# EAGLE design primer_piso (EAGLE 7.6.0)
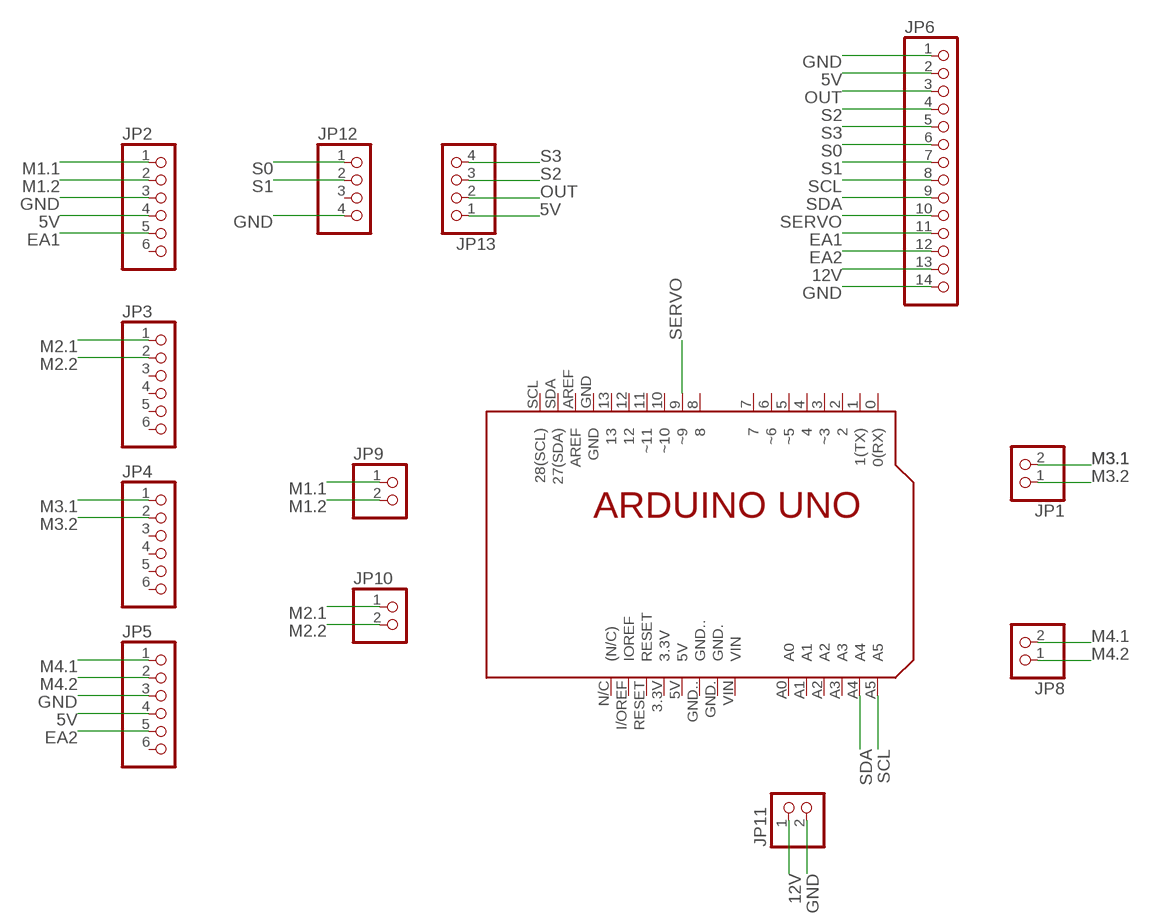
[diagram p0: schematic, sheet 1]

## Parts
JP1  PINHD-1X2  [1X02]
JP2  PINHD-1X6  [1X06]
JP3  PINHD-1X6  [1X06]
JP4  PINHD-1X6  [1X06]
JP5  PINHD-1X6  [1X06]
JP6  PINHD-1X14  [1X14]
JP8  PINHD-1X2  [1X02]
JP9  PINHD-1X2  [1X02]
JP10  PINHD-1X2  [1X02]
JP11  PINHD-1X2  [1X02]
JP12  PINHD-1X4  [1X04]
JP13  PINHD-1X4  [1X04]
UNO1  UNO  [UNO]

## Nets
5V: JP2.4 JP5.4 JP6.2 JP13.1
12V: JP6.13 JP11.1
EA1: JP2.5 JP6.11
EA2: JP5.5 JP6.12
GND: JP2.3 JP5.3 JP6.1 JP6.14 JP11.2 JP12.4
M1.1: JP2.1 JP9.1
M1.2: JP2.2 JP9.2
M2.1: JP3.1 JP10.1
M2.2: JP3.2 JP10.2
M3.1: JP1.2 JP4.1
M3.2: JP1.1 JP4.2
M4.1: JP5.1 JP8.2
M4.2: JP5.2 JP8.1
OUT: JP6.3 JP13.2
S0: JP6.6 JP12.1
S1: JP6.7 JP12.2
S2: JP6.4 JP13.3
S3: JP6.5 JP13.4
SCL: JP6.8 UNO1.A5
SDA: JP6.9 UNO1.A4
SERVO: JP6.10 UNO1.9(~9)
Unconnected: JP2.6 JP3.3 JP3.4 JP3.5 JP3.6 JP4.3 JP4.4 JP4.5 JP4.6 JP5.6 JP12.3 UNO1.0(0(RX)) UNO1.1(1(TX)) UNO1.2 UNO1.3(~3) UNO1.3.3V UNO1.4 UNO1.5(~5) UNO1.5V UNO1.6(~6) UNO1.7 UNO1.8 UNO1.10(~10) UNO1.11(~11) UNO1.12 UNO1.13 UNO1.A0 UNO1.A1 UNO1.A2 UNO1.A3 UNO1.AREF UNO1.GND UNO1.GND. UNO1.GND.. UNO1.I/OREF(IOREF) UNO1.N/C((N/C)) UNO1.RESET UNO1.SCL(28(SCL)) UNO1.SDA(27(SDA)) UNO1.VIN

## Library data of the parts
JP1 JP8-JP11 = pinhead:PINHD-1X2: PIN HEADER
JP2-JP5 = pinhead:PINHD-1X6: PIN HEADER
JP6 = pinhead:PINHD-1X14: PIN HEADER
JP12 JP13 = pinhead:PINHD-1X4: PIN HEADER
UNO1 = ROBORREGOS:UNO

## Board
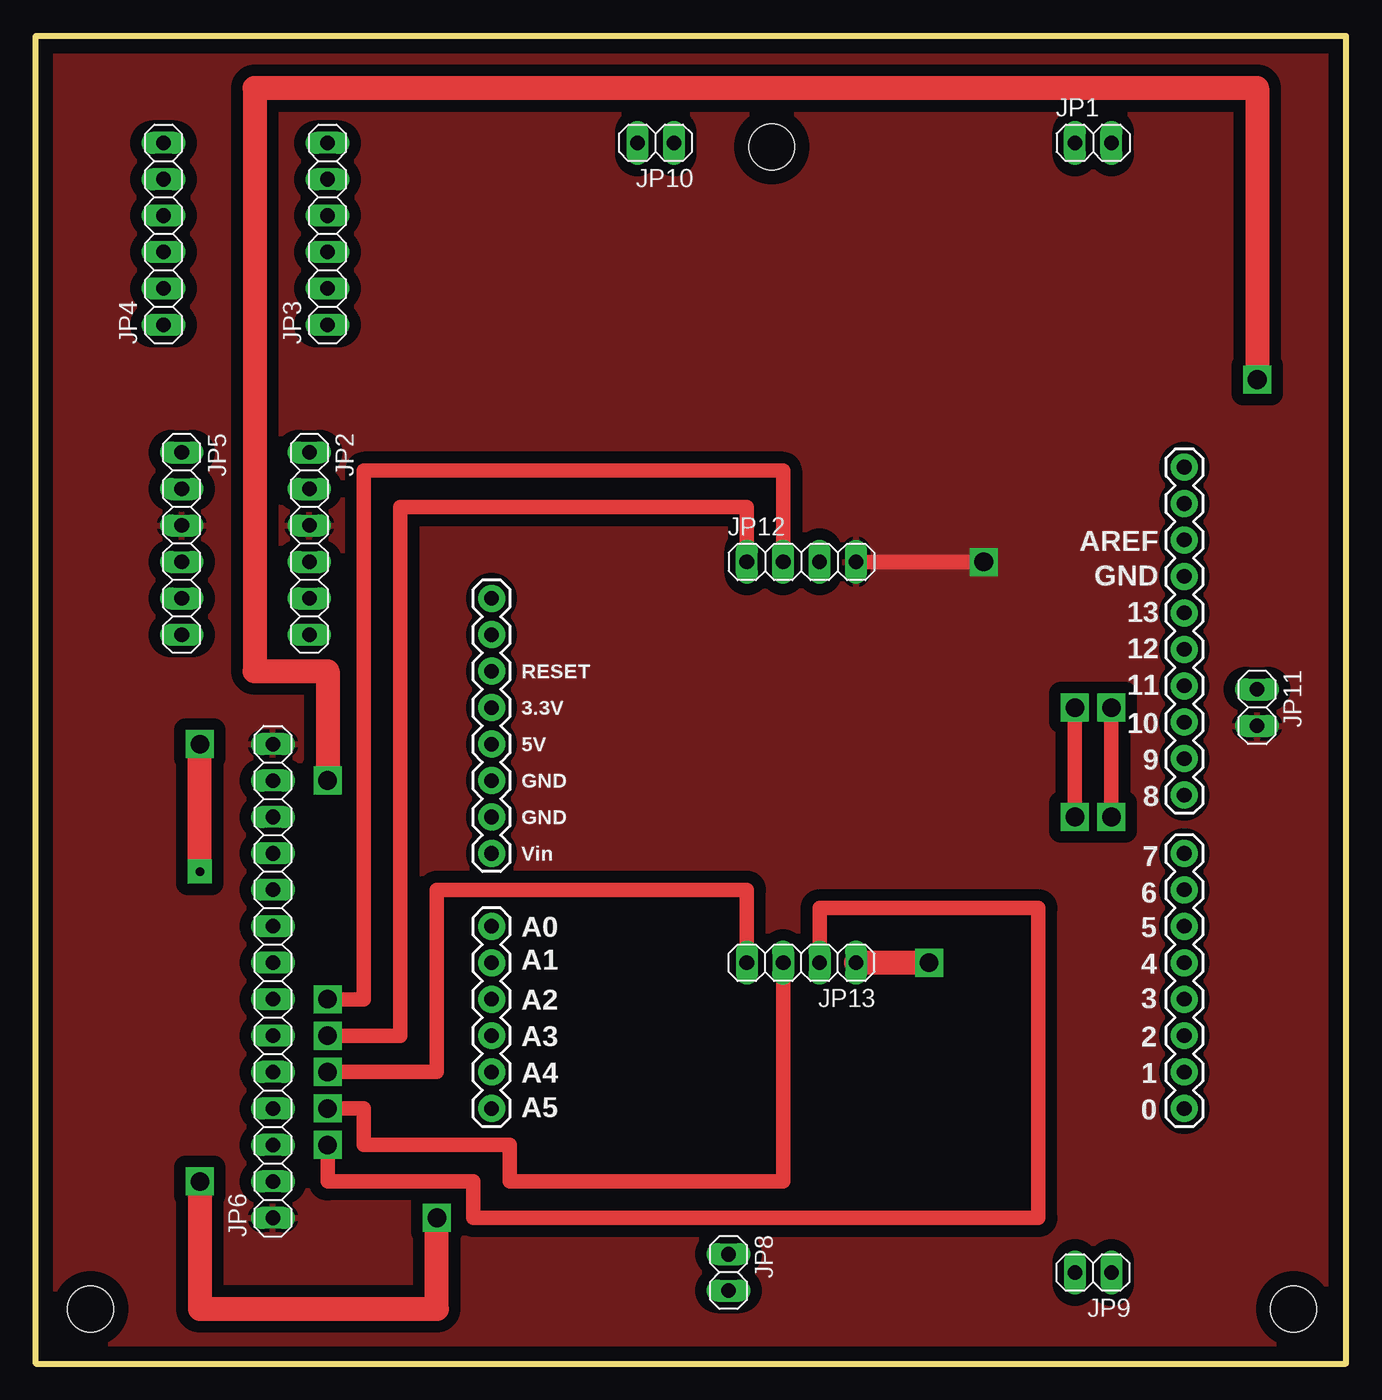
[diagram p1: board, top side]
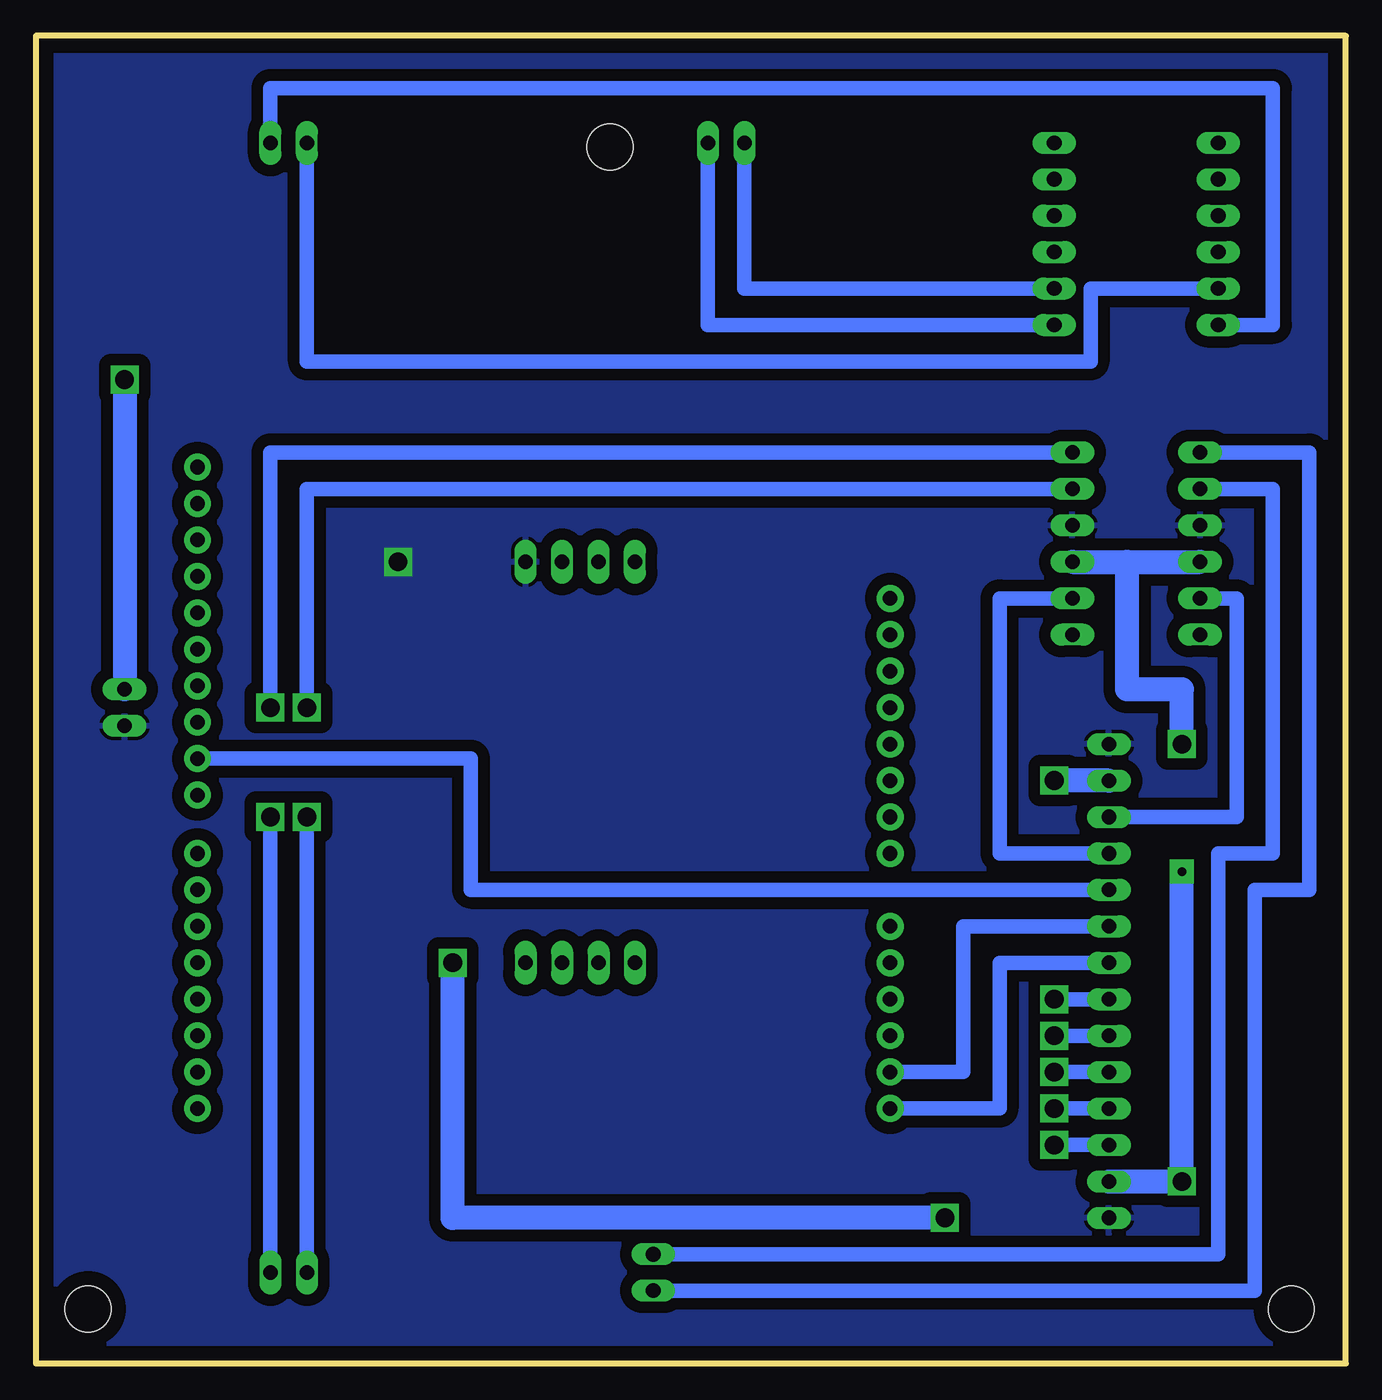
[diagram p2: board, bottom side, seen from below]

Size 91.27 x 92.54 mm. Coordinates in mm from the lower left corner, seen from the top.
Outline: 0,0 91.27,0 91.27,92.54 0,92.54 0,0
Copper layers (1*16): Top 0.035mm / dielectric 1.5mm / Bottom 0.035mm
Design rules "default": minimum track width 10mil, minimum drill 24mil, track to track 8mil, track to pad 8mil, pad to pad 8mil, via to via 8mil, smd to smd 8mil, copper to edge 40mil, drill to drill 8mil, minimum pad ring 10mil, minimum via ring 8mil, stop-mask expansion 4mil, vias tented up to drill 0mil, thermal gap 10mil
Holes 3.2 mm at 3.81,3.81 87.63,3.81 51.27,84.81

### Footprints (pad centres in the part's own frame; a part is rotated, then mirrored left to right if it is on the bottom)
1X02 = drill 1.016 long: 1 -1.27,0; 2 1.27,0
1X06 = drill 1.016 long: 1 -6.35,0; 2 -3.81,0; 3 -1.27,0; 4 1.27,0; 5 3.81,0; 6 6.35,0
1X14 = drill 1.016 long: 1 -16.51,0; 2 -13.97,0; 3 -11.43,0; 4 -8.89,0; 5 -6.35,0; 6 -3.81,0; 7 -1.27,0; 8 1.27,0; 9 3.81,0; 10 6.35,0; 11 8.89,0; 12 11.43,0; 13 13.97,0; 14 16.51,0
1X04 = drill 1.016 long: 1 -3.81,0; 2 -1.27,0; 3 1.27,0; 4 3.81,0
UNO = drill 1.016 pad 1.88: 0 31.75,24.13; 1 29.21,24.13; 2 26.67,24.13; 3 24.13,24.13; 3.3V 3.81,-24.13; 4 21.59,24.13; 5 19.05,24.13; 5V 6.35,-24.13; 6 16.51,24.13; 7 13.97,24.13; 8 9.906,24.13; 9 7.366,24.13; 10 4.826,24.13; 11 2.286,24.13; 12 -0.254,24.13; 13 -2.794,24.13; A0 19.05,-24.13; A1 21.59,-24.13; A2 24.13,-24.13; A3 26.67,-24.13; A4 29.21,-24.13; A5 31.75,-24.13; AREF -7.874,24.13; GND -5.334,24.13; GND. 11.43,-24.13; GND.. 8.89,-24.13; I/OREF -1.27,-24.13; N/C -3.81,-24.13; RESET 1.27,-24.13; SCL -12.954,24.13; SDA -10.414,24.13; VIN 13.97,-24.13

### Placement (x,y rotation side)
JP1  73.66,85.09 0 top
JP2  19.05,57.15 270 top
JP3  20.32,78.74 90 top
JP4  8.89,78.74 90 top
JP5  10.16,57.15 270 top
JP6  16.51,26.67 90 top
JP8  48.26,6.35 270 top
JP9  73.66,6.35 180 top
JP10  43.18,85.09 180 top
JP11  85.09,45.72 270 top
JP12  53.34,55.88 0 top
JP13  53.34,27.94 180 top
UNO1  55.88,49.53 270 top

### Tracks (layer width: path | path; a pad name or v marks a point on that pad's centre or on a via)
5V  (via drill 0.6 pad 1.68, 1.3, 1.3 pad 1.68)
  Top 1.676: v11.43,34.29 v11.43,43.18 | v11.43,12.7 11.43,3.81 27.94,3.81 v27.94,10.16 | v62.23,27.94 JP13.1
  Bottom 1.676: JP6.2 v11.43,12.7 v11.43,34.29 | v11.43,43.18 11.43,46.99 15.24,46.99 15.24,55.88 | 15.24,55.88 JP5.4 | JP2.4 15.24,55.88 | v27.94,10.16 62.23,10.16 v62.23,27.94
12V  (via drill 1.3, 1.3 pad 1.68)
  Top 1.676: v20.32,40.64 20.32,48.26 15.24,48.26 15.24,88.9 85.09,88.9 v85.09,68.58
  Bottom 1.676: v85.09,68.58 JP11.1 | JP6.13 v20.32,40.64
EA1
  Bottom 1.016: JP6.11 24.13,35.56 24.13,53.34 JP2.5
EA2
  Bottom 1.016: JP5.5 7.62,53.34 7.62,38.1 JP6.12
GND  (via drill 1.3)
  Top 1.016: JP12.4 v66.04,55.88
  Bottom 0.406: 86.36,44.45 JP11.2
  pour Bottom (isolate 0.813): -1.27,93.98 92.71,93.98 92.71,-1.27 -1.27,-1.27
  pour Top (isolate 0.813): -1.27,93.98 92.71,93.98 92.71,-1.27 -1.27,-1.27
M1.1  (via drill 1.3, 1.3 pad 1.02)
  Top 1.016: v74.93,45.72 v74.93,38.1
  Bottom 1.016: JP2.1 74.93,63.5 v74.93,45.72 | JP9.1 v74.93,38.1
M1.2  (via drill 1.3)
  Top 1.016: v72.39,38.1 v72.39,45.72
  Bottom 1.016: JP2.2 72.39,60.96 v72.39,45.72 | JP9.2 v72.39,38.1
M2.1
  Bottom 1.016: JP10.1 44.45,72.39 JP3.1
M2.2
  Bottom 1.016: JP10.2 41.91,74.93 JP3.2
M3.1
  Bottom 1.016: JP4.1 5.08,72.39 5.08,88.9 74.93,88.9 JP1.2
M3.2
  Bottom 1.016: JP4.2 17.78,74.93 17.78,69.85 72.39,69.85 JP1.1
M4.1
  Bottom 1.016: JP5.1 2.54,63.5 2.54,33.02 6.35,33.02 6.35,5.08 JP8.2
M4.2
  Bottom 1.016: JP5.2 5.08,60.96 5.08,35.56 8.89,35.56 8.89,7.62 JP8.1
OUT  (via drill 1.3 pad 1.02)
  Top 1.016: v20.32,15.24 20.32,12.7 30.48,12.7 30.48,10.16 69.85,10.16 69.85,31.75 54.61,31.75 JP13.2
  Bottom 1.016: JP6.3 v20.32,15.24
S0  (via drill 1.3 pad 1.02)
  Top 1.016: v20.32,22.86 25.4,22.86 25.4,59.69 49.53,59.69 JP12.1
  Bottom 1.016: v20.32,22.86 JP6.6
S1  (via drill 1.3)
  Top 1.016: v20.32,25.4 22.86,25.4 22.86,62.23 52.07,62.23 JP12.2
  Bottom 1.016: v20.32,25.4 JP6.7
S2  (via drill 1.3 pad 1.02)
  Top 1.016: v20.32,17.78 22.86,17.78 22.86,15.24 33.02,15.24 33.02,12.7 52.07,12.7 JP13.3
  Bottom 1.016: JP6.4 v20.32,17.78
S3  (via drill 1.3)
  Top 1.016: JP13.4 49.53,33.02 27.94,33.02 27.94,20.32 v20.32,20.32
  Bottom 1.016: v20.32,20.32 JP6.5
SCL
  Bottom 1.016: JP6.8 24.13,27.94 24.13,17.78 UNO1.A5
SDA
  Bottom 1.016: JP6.9 26.67,30.48 26.67,20.32 UNO1.A4
SERVO
  Bottom 1.016: JP6.10 60.96,33.02 60.96,41.91 60.96,42.16 UNO1.9